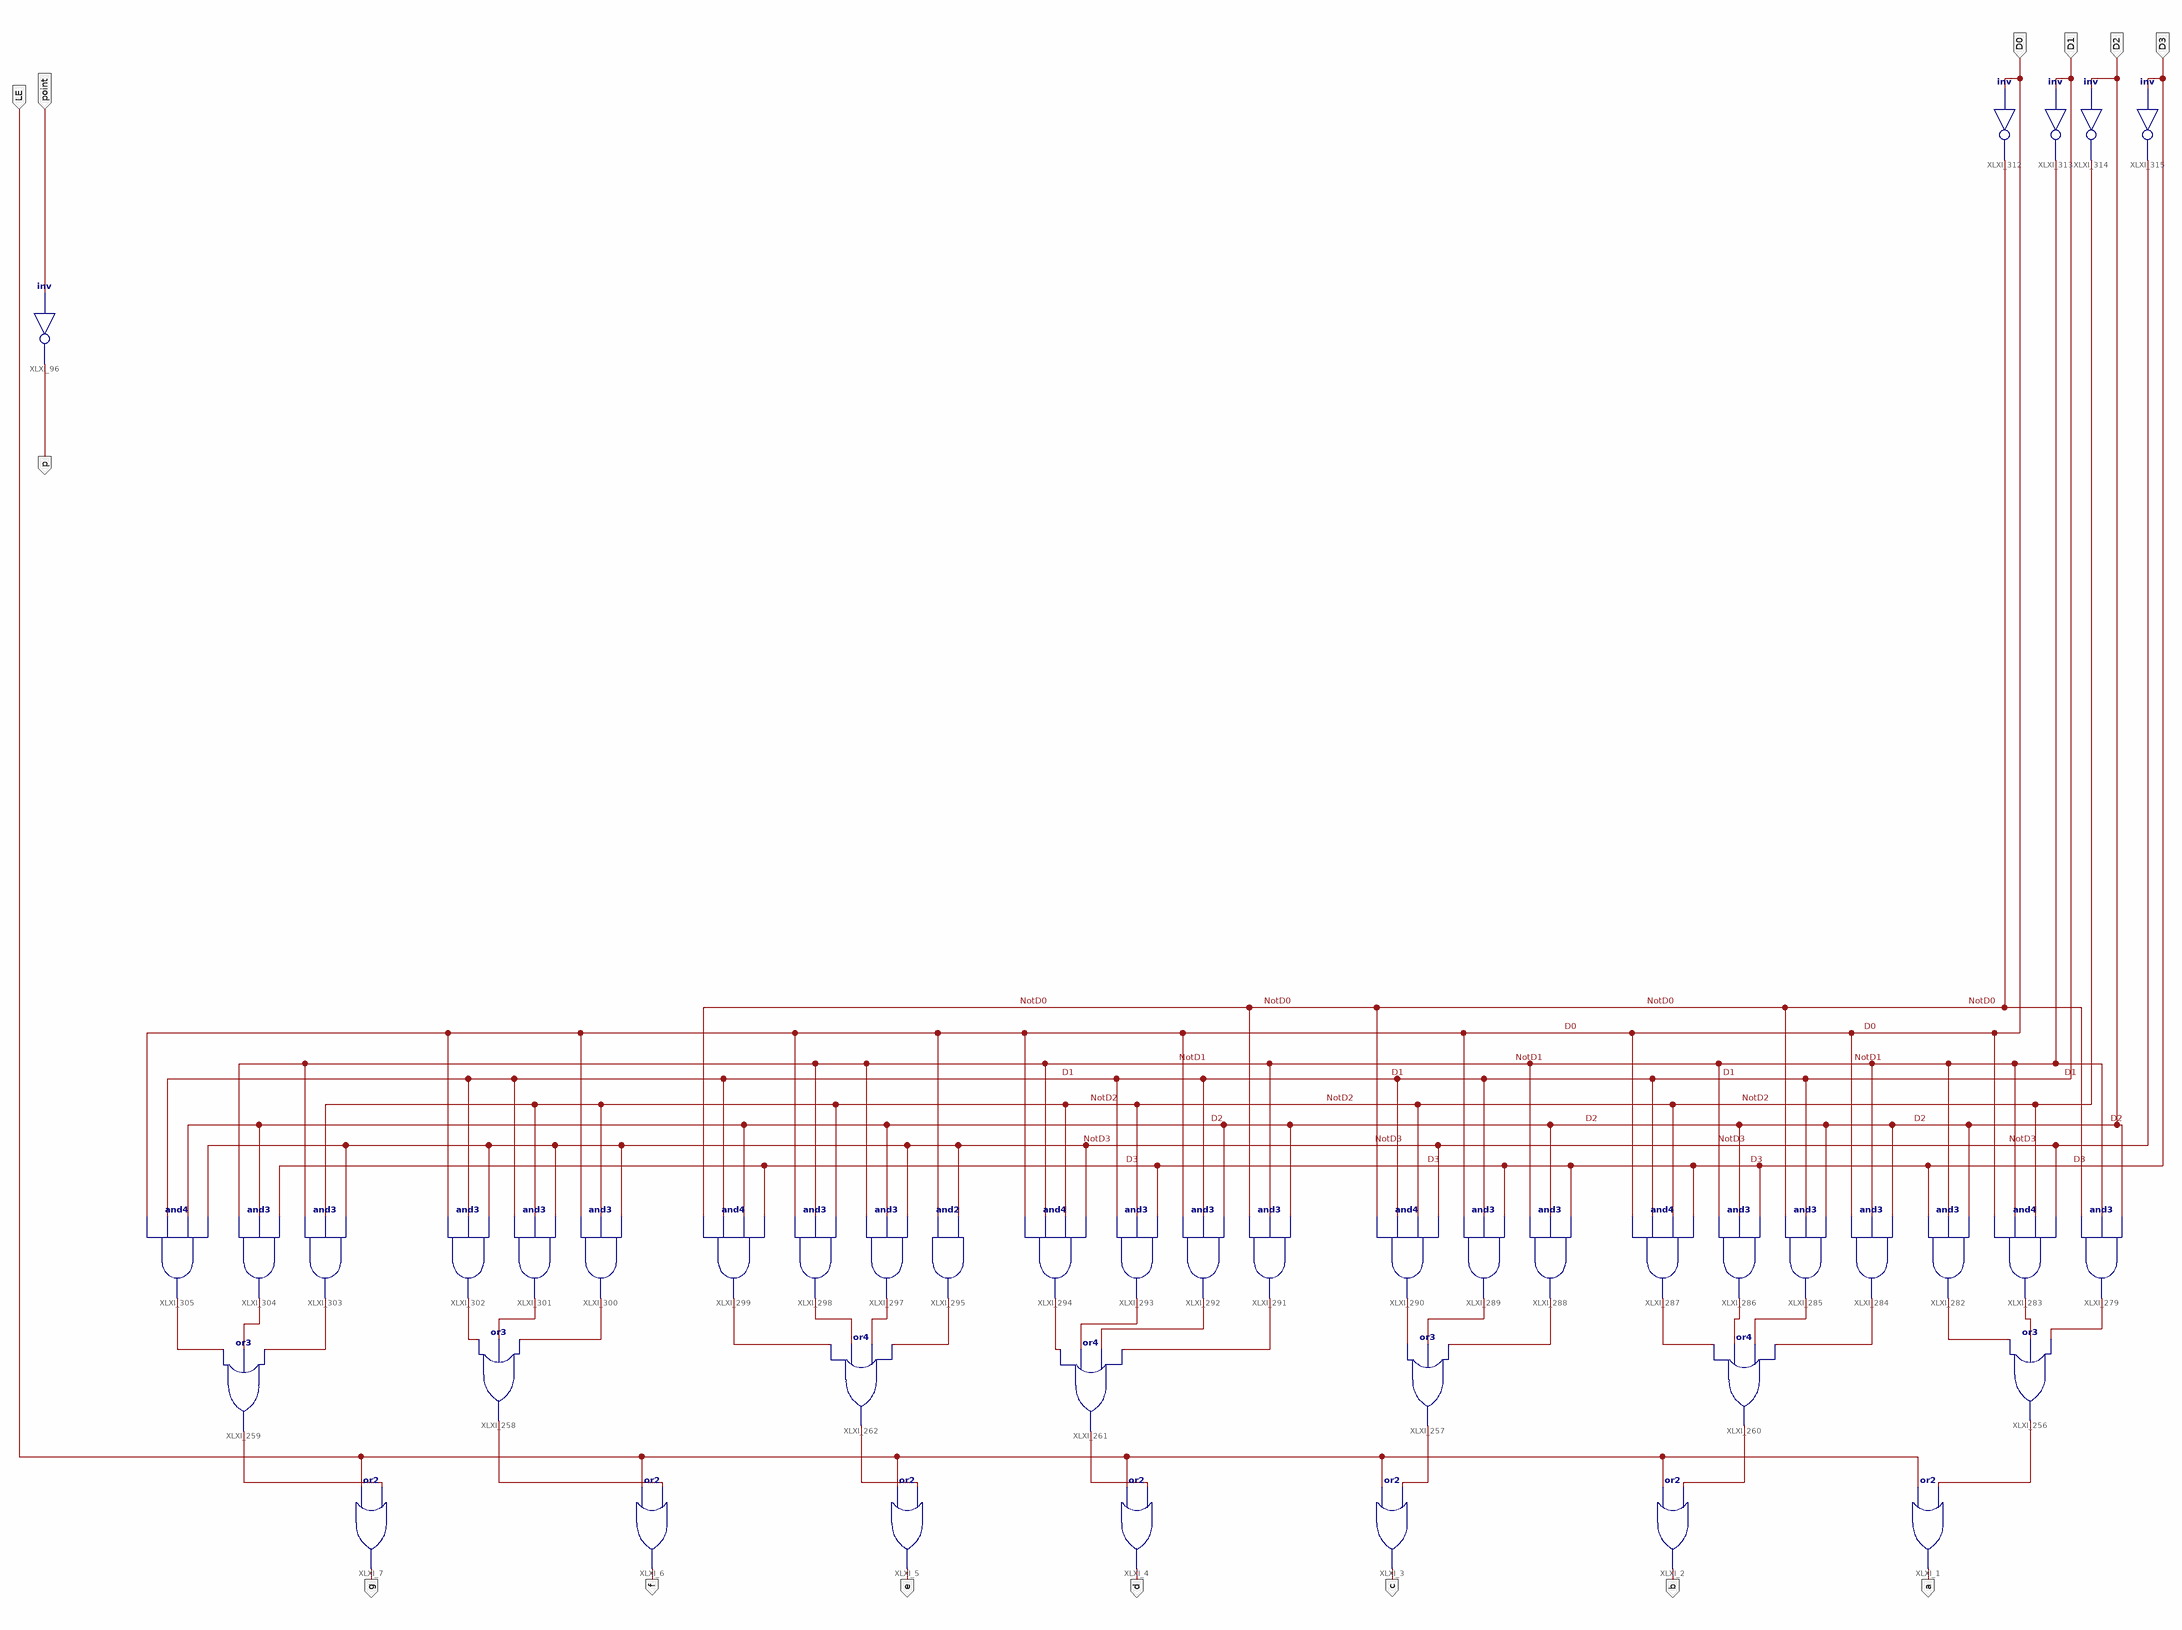
[diagram p0: schematic sheet 1]
// Xilinx ISE schematic PMC14495.sch (kintex7) as structural Verilog: 43 symbols, 14 ports
module PMC14495 (
  input  point,
  input  LE,
  input  D0,
  input  D1,
  input  D2,
  input  D3,
  output p,
  output g,
  output f,
  output e,
  output d,
  output c,
  output b,
  output a
);

  wire NotD0, NotD1, NotD2, NotD3, XLXN_76, XLXN_77, XLXN_79, XLXN_80, XLXN_81, XLXN_82, XLXN_84, XLXN_273,
       XLXN_274, XLXN_275, XLXN_276, XLXN_277, XLXN_278, XLXN_279, XLXN_280, XLXN_281, XLXN_282, XLXN_283,
       XLXN_284, XLXN_285, XLXN_286, XLXN_287, XLXN_288, XLXN_289, XLXN_290, XLXN_291, XLXN_292, XLXN_294,
       XLXN_295, XLXN_296, XLXN_297;

  not XLXI_96 (p, point);
  or XLXI_7 (g, LE, XLXN_84);
  or XLXI_6 (f, LE, XLXN_82);
  or XLXI_5 (e, LE, XLXN_81);
  or XLXI_4 (d, LE, XLXN_80);
  or XLXI_3 (c, LE, XLXN_79);
  or XLXI_2 (b, LE, XLXN_77);
  or XLXI_1 (a, LE, XLXN_76);
  or XLXI_256 (XLXN_76, XLXN_295, XLXN_296, XLXN_297);
  or XLXI_260 (XLXN_77, XLXN_290, XLXN_291, XLXN_292, XLXN_294);
  or XLXI_257 (XLXN_79, XLXN_287, XLXN_288, XLXN_289);
  or XLXI_258 (XLXN_82, XLXN_276, XLXN_277, XLXN_278);
  or XLXI_259 (XLXN_84, XLXN_273, XLXN_274, XLXN_275);
  or XLXI_261 (XLXN_80, XLXN_283, XLXN_284, XLXN_285, XLXN_286);
  or XLXI_262 (XLXN_81, XLXN_279, XLXN_280, XLXN_281, XLXN_282);
  and XLXI_279 (XLXN_297, NotD0, NotD1, D2);
  and XLXI_283 (XLXN_296, D0, NotD1, NotD2, NotD3);
  and XLXI_284 (XLXN_294, D0, NotD1, D2);
  and XLXI_286 (XLXN_291, NotD1, D2, D3);
  and XLXI_287 (XLXN_290, D0, D1, NotD2, D3);
  and XLXI_288 (XLXN_289, NotD1, D2, D3);
  and XLXI_289 (XLXN_288, D0, D1, D3);
  and XLXI_290 (XLXN_287, NotD0, D1, NotD2, NotD3);
  and XLXI_291 (XLXN_286, NotD0, NotD1, D2);
  and XLXI_292 (XLXN_285, D0, D1, D2);
  and XLXI_293 (XLXN_284, D1, NotD2, D3);
  and XLXI_294 (XLXN_283, D0, NotD1, NotD2, NotD3);
  and XLXI_295 (XLXN_282, D0, NotD3);
  and XLXI_297 (XLXN_281, NotD1, D2, NotD3);
  and XLXI_298 (XLXN_280, D0, NotD1, NotD2);
  and XLXI_299 (XLXN_279, NotD0, D1, D2, D3);
  and XLXI_300 (XLXN_278, D0, NotD2, NotD3);
  and XLXI_301 (XLXN_277, D1, NotD2, NotD3);
  and XLXI_303 (XLXN_275, NotD1, NotD2, NotD3);
  and XLXI_304 (XLXN_274, NotD1, D2, D3);
  not XLXI_312 (NotD0, D0);
  not XLXI_313 (NotD1, D1);
  not XLXI_314 (NotD2, D2);
  not XLXI_315 (NotD3, D3);
  and XLXI_282 (XLXN_295, D3, NotD1, D2);
  and XLXI_285 (XLXN_292, NotD0, D1, D2);
  and XLXI_302 (XLXN_276, D0, D1, NotD3);
  and XLXI_305 (XLXN_273, D0, D1, D2, NotD3);
endmodule
